# Altium schematic sheet MC33797.SchDoc: Top Sheet
size A4; Project: World Domination Satellite
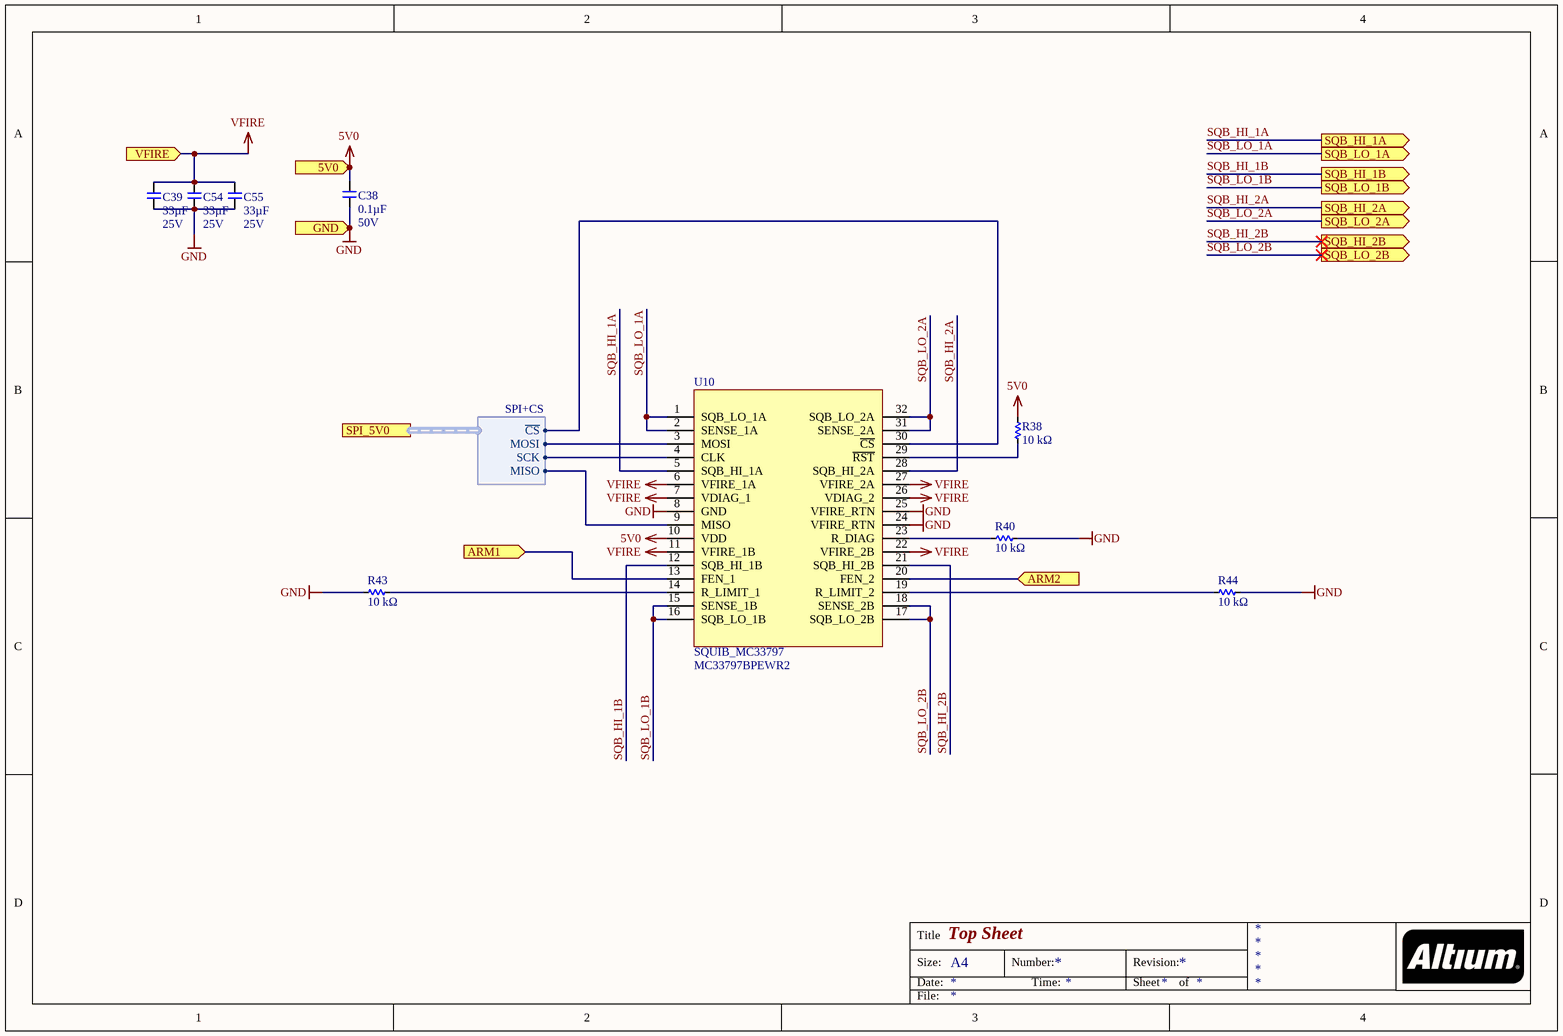
[diagram p0: MC33797.SchDoc]

## Parts
C38  Capacitance (shorthand): 0.1µF  Rated Voltage: 50V  [C0603]  (hidden comment: __template_cap)
C39  Capacitance: 33µF  Voltage - Rated: 25V  [C1206]  (hidden comment: CAP_33UF_1206_SMD)
C54  Capacitance: 33µF  Voltage - Rated: 25V  [C1206]  (hidden comment: CAP_33UF_1206_SMD)
C55  Capacitance: 33µF  Voltage - Rated: 25V  [C1206]  (hidden comment: CAP_33UF_1206_SMD)
R38  Resistance: 10 kΩ  [R0603]  (hidden comment: __template_resistor)
R40  Resistance: 10 kΩ  [R0603]  (hidden comment: __template_resistor)
R43  Resistance: 10 kΩ  [R0603]  (hidden comment: __template_resistor)
R44  Resistance: 10 kΩ  [R0603]  (hidden comment: __template_resistor)
U10  SQUIB_MC33797  Manufacturer Part Number: MC33797BPEWR2  [SOT1762-1]

## Ports
5V0 (in), ARM1 (in), ARM2 (in), GND (in), SPI_5V0 (harness SPI+CS), SQB_HI_1A (out), SQB_HI_1B (out), SQB_HI_2A (out), SQB_HI_2B (out), SQB_LO_1A (out), SQB_LO_1B (out), SQB_LO_2A (out), SQB_LO_2B (out), VFIRE (in)

## Harnesses
SPI+CS: ~{CS}, SCK, MOSI, MISO

## Nets
5V0: C38.1 R38.2 U10.10(VDD) ; port 5V0
GND: C38.2 C39.2 C54.2 C55.2 R40.2 R43.1 R44.2 U10.8(GND) U10.24(VFIRE_RTN) U10.25(VFIRE_RTN) ; port GND
VFIRE: C39.1 C54.1 C55.1 U10.6(VFIRE_1A) U10.7(VDIAG_1) U10.11(VFIRE_1B) U10.22(VFIRE_2B) U10.26(VDIAG_2) U10.27(VFIRE_2A) ; port VFIRE
ARM1: U10.13(FEN_1) ; port ARM1
ARM2: U10.20(FEN_2) ; port ARM2
SQB_HI_1A: U10.5(SQB_HI_1A) ; port SQB_HI_1A
SQB_HI_1B: U10.12(SQB_HI_1B) ; port SQB_HI_1B
SQB_HI_2A: U10.28(SQB_HI_2A) ; port SQB_HI_2A
SQB_HI_2B: U10.21(SQB_HI_2B) ; port SQB_HI_2B
SQB_LO_1A: U10.1(SQB_LO_1A) U10.2(SENSE_1A) ; port SQB_LO_1A
SQB_LO_1B: U10.15(SENSE_1B) U10.16(SQB_LO_1B) ; port SQB_LO_1B
SQB_LO_2A: U10.31(SENSE_2A) U10.32(SQB_LO_2A) ; port SQB_LO_2A
SQB_LO_2B: U10.17(SQB_LO_2B) U10.18(SENSE_2B) ; port SQB_LO_2B
NetR38_1: R38.1 U10.29(~{RST})
NetR40_1: R40.1 U10.23(R_DIAG)
NetR43_2: R43.2 U10.14(R_LIMIT_1)
NetR44_1: R44.1 U10.19(R_LIMIT_2)
NetU10_3: U10.3(MOSI) ; port SPI_5V0.MOSI
NetU10_4: U10.4(CLK) ; port SPI_5V0.SCK
NetU10_9: U10.9(MISO) ; port SPI_5V0.MISO
NetU10_30: U10.30(~{CS}) ; port SPI_5V0.~{CS}

## Notes on the sheet
- Title
- Size:
- Date:
- A4
- Number:
- Time:
- Revision:
- Sheet
- of
- File:

## Library data of the parts
C38 = CAP CER 0603 0.1µF X7R 50V 10%: Manufacturer: Murata Electronics North America; Capacitance - pF (Machine readable): 100000; type: capacitor; Dielectric: X7R; Supplier Part Number 1: 490-1519-1-ND; Supplier 1: Digikey
C39 C54 C55 = CAP_100UF_1206_SMD: 100UF SMD CAP CERAMIC; Manufacturer: Murata Electronics North America; Manufacturer Part Number: GRM31CD80J107ME39L; Tolerance: ±20%; Temperature Coefficient: X6T; RoHS: RoHS Compliant; Category: Capacitors; Packaging: Cut Tape (CT); Part Status: Active; Operating Temperature: -55°C ~ 105°C; Features: Derating Recommended; Ratings: -; Applications: General Purpose; Mounting Type: Surface Mount, MLCC; Package / Case: 1206 (3216 Metric); Size / Dimension: 0.126" L x 0.063" W (3.20mm x 1.60mm); Height - Seated (Max): -; Thickness (Max): 0.071" (1.80mm); Lead Spacing: -; Lead Style: -; Supplier 1: Digi-Key; Supplier Part Number 1: 445-8046-1-ND
R38 R40 R43 R44 = RES SMD 10K OHM 1% 1/10W 0603: Manufacturer Part Number: RC0603FR-0710KL; Manufacturer: Yageo; Resistance (Sortable): 10000; Tolerance: ±1%; Power (Watts): 0.1W, 1/10W; Temperature Coefficient: ±100ppm/°C; Supplier 1: Digikey; Datasheets: http://www.yageo.com/documents/recent/PYu-RC_Group_51_RoHS_L_9.pdf; Image: //media.digikey.com/Renders/Yageo%20Renders/0603-(1608-Metric).jpg; Supplier Part Number 1: 311-10.0KHRCT-ND; Operating Temperature: -55°C ~ 155°C
U10 = SQUIB_MC33797: Manufacturer: NXP USA Inc.; Interface: SPI; Voltage - Supply: 4.75 V ~ 5.25 V; Supplier 1: Digi-Key; RoHS: RoHS Compliant; Category: Integrated Circuits (ICs); Stock 1: 657; Pricing 1: 1=4.94, 10=4.437, 100=3.6354, 500=3.2136 (USD); Packaging: Cut Tape (CT); Part Status: Active; Applications: -; Package / Case: 32-SOIC (0.295", 7.50mm Width); Supplier Device Package: 32-SOIC; Mounting Type: Surface Mount; ComponentLink1URL: http://cache.freescale.com/files/analog/doc/data_sheet/MC33797.pdf; ComponentLink1Description: http://cache.freescale.com/files/analog/doc/data_sheet/MC33797.pdf; Supplier Part Number 1: MC33797BPEWR2CT-ND